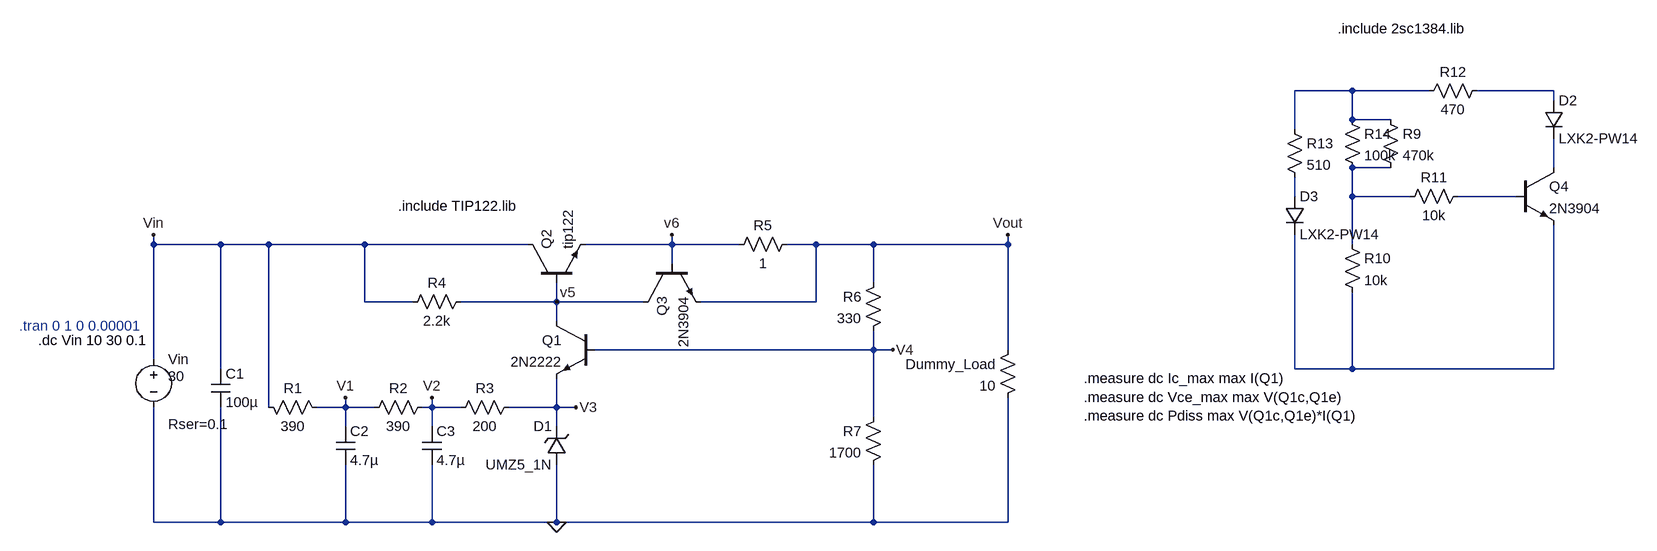
[diagram p0: schematic CEN304-Project-2.asc]
CEN304-Project-2.asc, the LTspice schematic file:
Version 4.1
SHEET 1 4340 680
WIRE 3856 -320 3760 -320
WIRE 3984 -320 3856 -320
WIRE 4192 -320 4064 -320
WIRE 4192 -304 4192 -320
WIRE 3856 -272 3856 -320
WIRE 3920 -272 3856 -272
WIRE 3760 -256 3760 -320
WIRE 3920 -192 3856 -192
WIRE 4192 -192 4192 -240
WIRE 3760 -144 3760 -176
WIRE 3856 -144 3856 -192
WIRE 3952 -144 3856 -144
WIRE 4128 -144 4032 -144
WIRE -16 -64 -16 -80
WIRE 96 -64 -16 -64
WIRE 176 -64 96 -64
WIRE 336 -64 176 -64
WIRE 608 -64 336 -64
WIRE 848 -64 848 -80
WIRE 848 -64 704 -64
WIRE 960 -64 848 -64
WIRE 1088 -64 1040 -64
WIRE 1184 -64 1088 -64
WIRE 1408 -64 1408 -80
WIRE 1408 -64 1184 -64
WIRE 3856 -64 3856 -144
WIRE 848 -32 848 -64
WIRE 1184 0 1184 -64
WIRE 336 32 336 -64
WIRE 416 32 336 32
WIRE 656 32 656 0
WIRE 656 32 496 32
WIRE 800 32 656 32
WIRE 1088 32 1088 -64
WIRE 1088 32 896 32
WIRE 656 64 656 32
WIRE 1184 112 1184 80
WIRE 1184 112 720 112
WIRE 1216 112 1184 112
WIRE 1408 112 1408 -64
WIRE -16 128 -16 -64
WIRE 96 144 96 -64
WIRE 3760 144 3760 -80
WIRE 3856 144 3856 16
WIRE 3856 144 3760 144
WIRE 4192 144 4192 -96
WIRE 4192 144 3856 144
WIRE 176 208 176 -64
WIRE 304 208 304 192
WIRE 304 208 256 208
WIRE 352 208 304 208
WIRE 448 208 448 192
WIRE 448 208 432 208
WIRE 496 208 448 208
WIRE 656 208 656 160
WIRE 656 208 576 208
WIRE 688 208 656 208
WIRE 1184 224 1184 112
WIRE 304 240 304 208
WIRE 448 240 448 208
WIRE 656 240 656 208
WIRE -16 400 -16 208
WIRE 96 400 96 208
WIRE 96 400 -16 400
WIRE 304 400 304 304
WIRE 304 400 96 400
WIRE 448 400 448 304
WIRE 448 400 304 400
WIRE 656 400 656 304
WIRE 656 400 448 400
WIRE 1184 400 1184 304
WIRE 1184 400 656 400
WIRE 1408 400 1408 192
WIRE 1408 400 1184 400
FLAG 656 400 0
FLAG 304 192 V1
FLAG 448 192 V2
FLAG 688 208 V3
FLAG 1216 112 V4
FLAG -16 -80 Vin
FLAG 656 32 v5
FLAG 1408 -80 Vout
FLAG 848 -80 v6
SYMBOL voltage -16 112 R0
WINDOW 123 0 0 Left 0
WINDOW 39 24 124 Left 2
WINDOW 3 24 44 Left 2
SYMATTR SpiceLine Rser=0.1
SYMATTR Value 30
SYMATTR InstName Vin
SYMBOL cap 80 144 R0
SYMATTR InstName C1
SYMATTR Value 100µ
SYMBOL res 160 192 M90
WINDOW 0 0 56 VBottom 2
WINDOW 3 32 56 VTop 2
SYMATTR InstName R1
SYMATTR Value 390
SYMBOL cap 288 240 R0
SYMATTR InstName C2
SYMATTR Value 4.7µ
SYMBOL cap 432 240 R0
SYMATTR InstName C3
SYMATTR Value 4.7µ
SYMBOL zener 672 304 R180
WINDOW 0 24 64 Left 2
WINDOW 3 24 0 Left 2
SYMATTR InstName D1
SYMATTR Value UMZ5_1N
SYMBOL npn 720 64 M0
SYMATTR InstName Q1
SYMATTR Value 2N2222
SYMBOL res 336 224 R270
WINDOW 0 32 56 VTop 2
WINDOW 3 0 56 VBottom 2
SYMATTR InstName R2
SYMATTR Value 390
SYMBOL res 480 224 R270
WINDOW 0 32 56 VTop 2
WINDOW 3 0 56 VBottom 2
SYMATTR InstName R3
SYMATTR Value 200
SYMBOL res 400 48 R270
WINDOW 0 32 56 VTop 2
WINDOW 3 0 56 VBottom 2
SYMATTR InstName R4
SYMATTR Value 2.2k
SYMBOL npn 800 -32 M90
SYMATTR InstName Q3
SYMATTR Value 2N3904
SYMBOL res 944 -48 R270
WINDOW 0 32 56 VTop 2
WINDOW 3 0 56 VBottom 2
SYMATTR InstName R5
SYMATTR Value 1
SYMBOL res 1200 -16 M0
SYMATTR InstName R6
SYMATTR Value 330
SYMBOL res 1200 208 M0
SYMATTR InstName R7
SYMATTR Value 1700
SYMBOL res 1424 96 M0
SYMATTR InstName Dummy_Load
SYMATTR Value 10
SYMATTR SpiceLine pwr=30
SYMBOL res 3904 -288 R0
SYMATTR InstName R9
SYMATTR Value 470k
SYMBOL res 3840 -80 R0
SYMATTR InstName R10
SYMATTR Value 10k
SYMBOL res 3936 -128 R270
WINDOW 0 32 56 VTop 2
WINDOW 3 0 56 VBottom 2
SYMATTR InstName R11
SYMATTR Value 10k
SYMBOL npn 4128 -192 R0
SYMATTR InstName Q4
SYMATTR Value 2N3904
SYMBOL diode 4176 -304 R0
SYMATTR InstName D2
SYMATTR Value LXK2-PW14
SYMBOL res 3968 -304 R270
WINDOW 0 32 56 VTop 2
WINDOW 3 0 56 VBottom 2
SYMATTR InstName R12
SYMATTR Value 470
SYMBOL diode 3744 -144 R0
SYMATTR InstName D3
SYMATTR Value LXK2-PW14
SYMBOL res 3744 -272 R0
SYMATTR InstName R13
SYMATTR Value 510
SYMBOL res 3840 -288 R0
SYMATTR InstName R14
SYMATTR Value 100k
SYMBOL npn 608 0 R270
SYMATTR InstName Q2
SYMATTR Value tip122
SYMATTR Prefix X
TEXT -208 96 Left 2 !.dc Vin 10 30 0.1
TEXT -240 72 Left 2 ;.tran 0 1 0 0.00001
TEXT 3832 -424 Left 2 !.include 2sc1384.lib
TEXT 3408 160 Left 2 !.measure dc Ic_max max I(Q1)\n.measure dc Vce_max max V(Q1c,Q1e)\n.measure dc Pdiss max V(Q1c,Q1e)*I(Q1)
TEXT 392 -128 Left 2 !.include TIP122.lib

The netlist it stands for:
* CEN304-Project-2.asc
Vin Vin 0 30 Rser=0.1
C1 Vin 0 100µ
R1 Vin V1 390
C2 V1 0 4.7µ
C3 V2 0 4.7µ
D1 0 V3 UMZ5_1N
Q1 v5 V4 V3 0 2N2222
R2 V1 V2 390
R3 V2 V3 200
R4 Vin v5 2.2k
Q3 v5 v6 Vout 0 2N3904
R5 v6 Vout 1
R6 Vout V4 330
R7 V4 0 1700
R§Dummy_Load Vout 0 10 pwr=30
R9 N001 N003 470k
R10 N003 N007 10k
R11 N003 N006 10k
Q4 N004 N006 N007 0 2N3904
D2 N002 N004 LXK2-PW14
R12 N001 N002 470
D3 N005 N007 LXK2-PW14
R13 N001 N005 510
R14 N001 N003 100k
X§Q2 Vin v5 v6 tip122  ; pins C B E
.model D D
.lib standard.dio
.model NPN NPN
.model PNP PNP
.lib standard.bjt
.dc Vin 10 30 0.1
* .tran 0 1 0 0.00001
.include 2sc1384.lib
.measure dc Ic_max max I(Q1)
.measure dc Vce_max max V(Q1c,Q1e)
.measure dc Pdiss max V(Q1c,Q1e)*I(Q1)
.include TIP122.lib
.backanno
.end